# EAGLE design output (EAGLE 6.6.0)
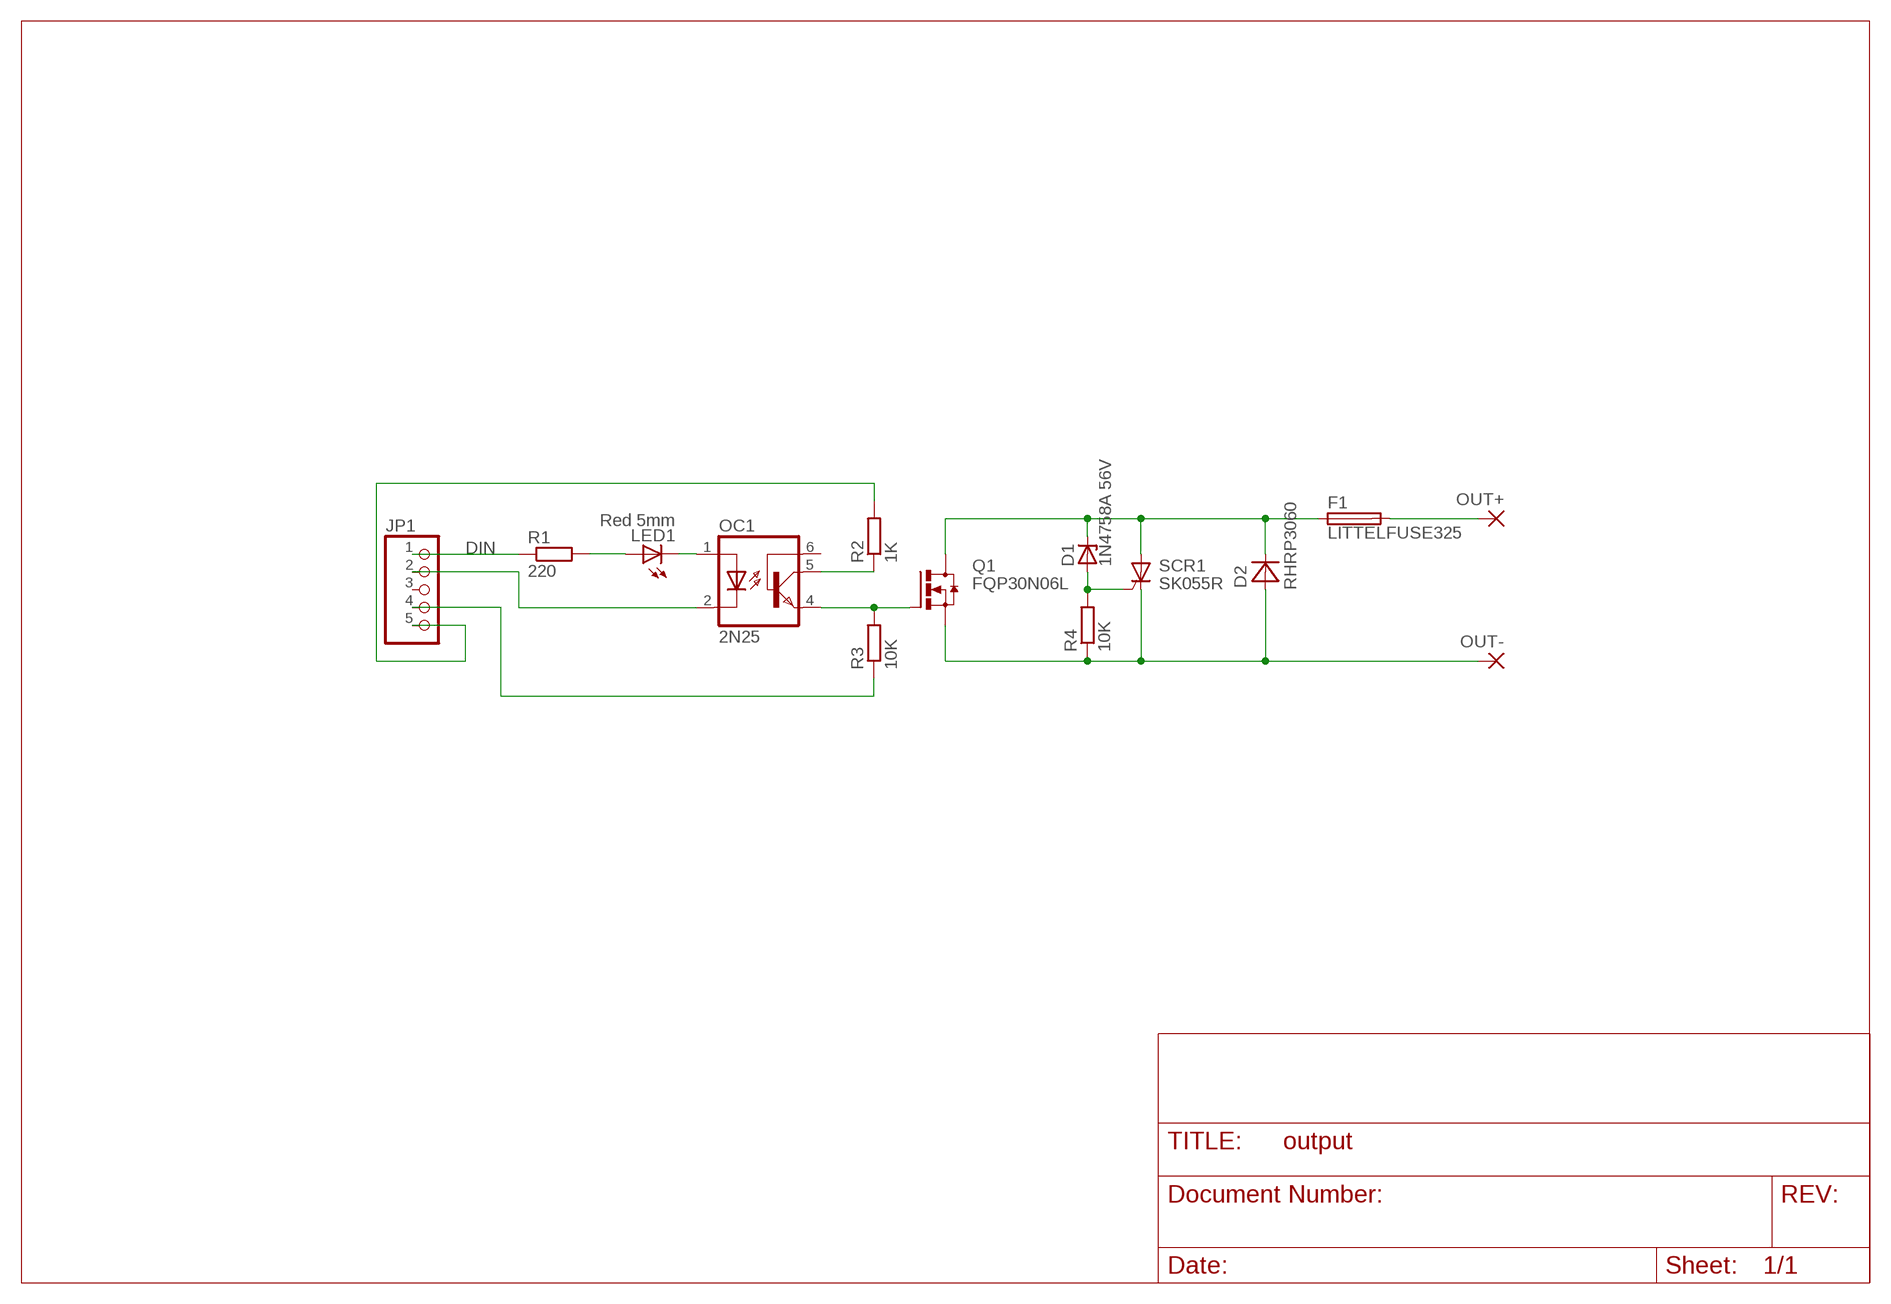
[diagram p0: schematic, sheet 1]

## Parts
D1  1N4758A 56V  ZENER-DIODEDO41Z10  [DO41Z10]
D2  RHRP3060  RHRP3060HEATSINK  [TO-220CAS-HS]
F1  LITTELFUSE325  [LITTELFUSE-325]
JP1  PINHD-1X5  [1X05]
LED1  Red 5mm  LED5MM  [LED5MM]
OC1  2N25  [DIL-06]
OUT+  2,54/1,1  [2,54/1,1]
OUT-  2,54/1,1  [2,54/1,1]
Q1  FQP30N06L  FQP30N06LHEATSINK  [TO-220BV-HS]
R1  220  R-EU_0207/10  [0207/10]
R2  1K  R-EU_0207/10  [0207/10]
R3  10K  R-EU_0207/10  [0207/10]
R4  10K  R-EU_0207/10  [0207/10]
SCR1  SK055R  SK055RHEATSINK  [TO-220V-HS]

## Nets
DGND: JP1.2 OC1.2(C)
DIN: JP1.1 R1.1
ISOL_GND: JP1.4 R3.1
ISOL_OUT+: D1.C D2.C F1.P$1 Q1.D SCR1.2(A)
ISOL_OUT-: D2.A OUT-.1(P) Q1.S R4.1 SCR1.1(C)
ISOL_VDD: JP1.5 R2.2
N$1: D1.A R4.2 SCR1.3(G)
N$2: OC1.5(COL) R2.1
N$3: OC1.4(EMI) Q1.G R3.2
N$4: LED1.K(C) OC1.1(A)
N$5: LED1.A R1.2
N$6: F1.P$2 OUT+.1(P)
Unconnected: JP1.3 OC1.6(BAS)

## Library data of the parts
D1 = diode:ZENER-DIODE: Z-Diode
D2 = djm:RHRP3060: Fairchild RHRP3060 high-current rectifier 30A 600V
F1 = djm:LITTELFUSE325: Littelfuse 325-series leaded fuse Ceramic fuse from Littelfuse. Taken from http://www.farnell.com/datasheets/48457.pdf
JP1 = pinhead:PINHD-1X5: PIN HEADER
LED1 = led:LED: LED OSRAM: - CHIPLED LG R971, LG N971, LY N971, LG Q971, LY Q971, LO R971, LY R971 LH N974, LH R974 LS Q976, LO Q976, LY Q976 LO Q996 - Hyper CHIPLED LW Q18S LB Q993, LB Q99A, LB R99A - SideLED LS A670, LO A670, LY A670, LG A670, LP A670 LB A673, LV A673, LT A673, LW A673 LH A674 LY A675 LS A676, LA A676, LO A676, LY A676, LW A676 LS A679, LY A679, LG A679 - Hyper Micro SIDELED® LS Y876, LA Y876, LO Y876, LY Y876 LT Y87S - SmartLED LW L88C, LW L88S LB L89C, LB L89S, LG L890 LS L89K, LO L89K, LY L89K LS L896, LA L896, LO L896, LY L896 - TOPLED LS T670, LO T670, LY T670, LG T670, LP T670 LSG T670, LSP T670, LSY T670, LOP T670, LYG T670 LG T671, LOG T671, LSG T671 LB T673, LV T673, LT T673, LW T673 LH T674 LS T676, LA T676, LO T676, LY T676, LB T676, LH T676, LSB T676, LW T676 LB T67C, LV T67C, LT T67C, LS T67K, LO T67K, LY T67K, LW E67C LS E67B, LA E67B, LO E67B, LY E67B, LB E67C, LV E67C, LT E67C LW T67C LS T679, LY T679, LG T679 LS T770, LO T770, LY T770, LG T770, LP T770 LB T773, LV T773, LT T773, LW T773 LH T774 LS E675, LA E675, LY E675, LS T675 LS T776, LA T776, LO T776, LY T776, LB T776 LHGB T686 LT T68C, LB T68C - Hyper Mini TOPLED® LB M676 - Mini TOPLED Santana® LG M470 LS M47K, LO M47K, LY M47K Source: http://www.osram.convergy.de LUXEON: - LUMILED® LXK2-PW12-R00, LXK2-PW12-S00, LXK2-PW14-U00, LXK2-PW14-V00 LXK2-PM12-R00, LXK2-PM12-S00, LXK2-PM14-U00 LXK2-PE12-Q00, LXK2-PE12-R00, LXK2-PE12-S00, LXK2-PE14-T00, LXK2-PE14-U00 LXK2-PB12-K00, LXK2-PB12-L00, LXK2-PB12-M00, LXK2-PB14-N00, LXK2-PB14-P00, LXK2-PB14-Q00 LXK2-PR12-L00, LXK2-PR12-M00, LXK2-PR14-Q00, LXK2-PR14-R00 LXK2-PD12-Q00, LXK2-PD12-R00, LXK2-PD12-S00 LXK2-PH12-R00, LXK2-PH12-S00 LXK2-PL12-P00, LXK2-PL12-Q00, LXK2-PL12-R00 Source: www.luxeon.com KINGBRIGHT: KA-3528ASYC Source: www.kingbright.com
OC1 = djm:2N25: 2N25 NPN optocoupler
OUT+ OUT- = wirepad:2,54/1,1: THROUGH-HOLE PAD
Q1 = djm:FQP30N06L: FQP30N06L N-Channel MOSFET 32A 60V logic-level http://www.fairchildsemi.com/ds/FQ/FQP30N06L.pdf
R1-R4 = resistor:R-EU_: RESISTOR, European symbol
SCR1 = djm:SK055R: Littelfuse SK055R 55A 1000V SCR http://www.littelfuse.com/~/media/electronics/datasheets/switching_thyristors/littelfuse_thyristor_sxx55x_datasheet.pdf.pdf

## Board
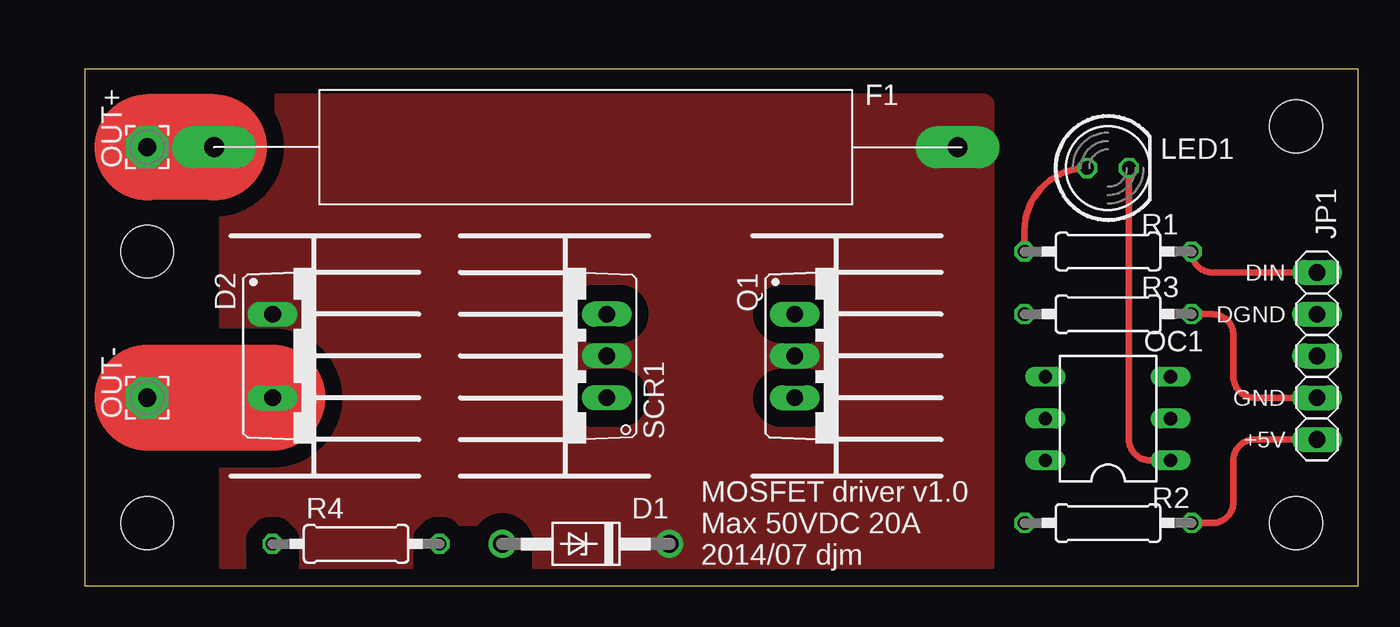
[diagram p1: board, top side]
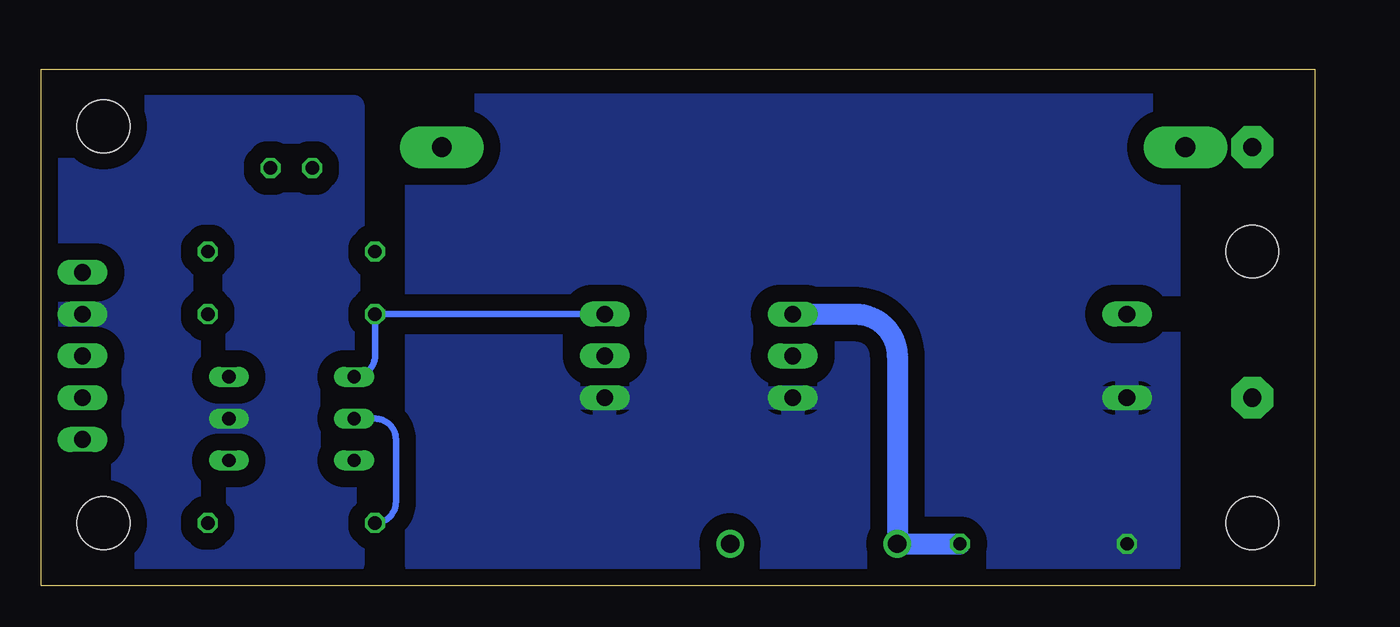
[diagram p2: board, bottom side, seen from below]

Size 77.45 x 31.42 mm. Coordinates in mm from the lower left corner, seen from the top.
Outline: 0,0 77.45,0 77.45,31.42 0,31.42 0,0
Copper layers (1*16): Top 0.0356mm / dielectric 1.5011mm / Bottom 0.0356mm
Design rules "LaenPCBOrder": minimum track width 6mil, minimum drill 13mil, track to track 6mil, track to pad 6mil, pad to pad 6mil, via to via 6mil, smd to smd 6mil, copper to edge 15mil, drill to drill 6mil, minimum pad ring 7mil, minimum via ring 7mil, stop-mask expansion 3mil, vias tented up to drill 0mil, thermal gap 10mil
Holes 3.2 mm at 3.81,3.81 3.81,20.32 73.66,27.94 73.66,3.81

### Footprints (pad centres in the part's own frame; a part is rotated, then mirrored left to right if it is on the bottom)
DO41Z10 = drill 1.118: A 5.08,0; C -5.08,0
TO-220CAS-HS = drill 1.016 long: A 2.54,0; C -2.54,0
LITTELFUSE-325 = drill 1.2 pad 2.54 long: P$1 -22.606,0; P$2 22.606,0
1X05 = drill 1.016 long: 1 -5.08,0; 2 -2.54,0; 3 0,0; 4 2.54,0; 5 5.08,0
LED5MM = drill 0.813 octagon: A -1.27,0; K 1.27,0
DIL-06 = drill 0.813 long: 1 -2.54,-3.81; 2 0,-3.81; 3 2.54,-3.81; 4 2.54,3.81; 5 0,3.81; 6 -2.54,3.81
2,54/1,1 = drill 1.118 pad 2.54 octagon: 1 0,0
TO-220BV-HS = drill 1.016 long: D 0,0; G -2.54,0; S 2.54,0
0207/10 = drill 0.813 octagon: 1 -5.08,0; 2 5.08,0
TO-220V-HS = drill 1.016 long: 1 -2.54,0; 2 0,0; 3 2.54,0

### Placement (x,y rotation side)
D1  30.48,2.54 180 top
D2  11.43,13.97 270 top
F1  30.48,26.67 180 top
JP1  74.93,13.97 270 top
LED1  62.23,25.4 0 top
OC1  62.23,10.16 90 top
OUT+  3.81,26.67 90 top
OUT-  3.81,11.43 90 top
Q1  43.18,13.97 270 top
R1  62.23,20.32 180 top
R2  62.23,3.81 0 top
R3  62.23,16.51 180 top
R4  16.51,2.54 0 top
SCR1  31.75,13.97 90 top

### Tracks (layer width: path | path; a pad name or v marks a point on that pad's centre or on a via)
DGND
  pour Bottom (isolate 1.016, no thermals): 76.2,29.21 58.42,29.21 58.42,1.27 76.2,1.27
DIN
  Top 0.406: JP1.1 68.58,19.05 arc-90 R1.1
ISOL_GND
  Top 0.406: JP1.4 71.12,11.43 arc-90 69.85,12.7 69.85,15.24 arc90 68.58,16.51 R3.1
ISOL_OUT+
  pour Top (isolate 1.016, no thermals): 8.89,1.27 8.89,29.21 54.61,29.21 54.61,1.27
ISOL_OUT-
  Top 6.452: D2.A OUT-.1
  pour Bottom (isolate 1.016): 8.89,1.27 8.89,29.21 54.61,29.21 54.61,1.27
ISOL_VDD
  Top 0.406: R2.2 68.58,3.81 arc90 69.85,5.08 69.85,7.62 arc-90 71.12,8.89 JP1.5
N$1
  Bottom 1.27: SCR1.3 27.94,16.51 arc90 25.4,13.97 D1.A R4.2
N$2
  Bottom 0.406: R2.1 arc-90 55.88,5.08 55.88,8.89 arc-90 57.15,10.16 OC1.5
N$3
  Bottom 0.406: OC1.4 arc-90 57.15,13.97 R3.2 Q1.G
N$4
  Top 0.406: OC1.1 64.77,7.62 arc-90 63.5,8.89 LED1.K
N$5
  Top 0.406: R1.2 57.15,21.59 arc-90 LED1.A
N$6
  Top 6.452: F1.P$2 OUT+.1

### Text on the board
tNames: DIN | DGND | GND | +5V | MOSFET driver v1.0 / Max 50VDC 20A / 2014/07 djm